# EAGLE design Aliexpress MMA8452 (EAGLE 9.2.2)
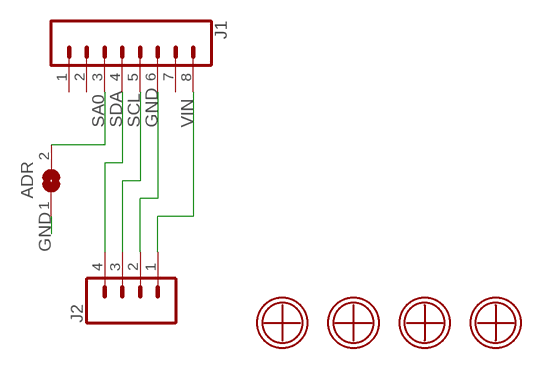
[diagram p0: schematic, sheet 1]

## Parts
ADR  SOLDERJUMPERREFLOW  [SOLDERJUMPER_REFLOW]
J1  CONN_08"  [1X08]
J2  CONN_04  [1X04]
U$1  3.2MM-5MM  [3.2MM-5MM]
U$2  3.2MM-5MM  [3.2MM-5MM]
U$3  3.2MM-5MM  [3.2MM-5MM]
U$4  3.2MM-5MM  [3.2MM-5MM]

## Nets
GND: ADR.1 J1.6 J2.2
SA0: ADR.2 J1.3
SCL: J1.5 J2.3
SDA: J1.4 J2.4
VIN: J1.8 J2.1
Unconnected: J1.1 J1.2 J1.7 U$1.P$1 U$2.P$1 U$3.P$1 U$4.P$1

## Library data of the parts
ADR = #microbuilder:SOLDERJUMPER: SMD Solder JUMPER Solder the two pads together to create a connection, or remove the solder to break it. REFLOW - Use this footprint for solder paste and reflow ovens. WAVE - Use this footprint for hand-soldering (larger pads). CLOSED - Has a trace between the two pads to ensure it is closed by default. The trace needs to be cut to disable the jumper, and can be closed again by creating a solder bridge between the two pads.
J1 = SparkFun-Connectors:CONN_08: Multi connection point. Often used as Generic Header-pin footprint for 0.1 inch spaced/style header connections On any of the 0.1 inch spaced packages, you can populate with these: Break Away Headers - Straight <https://www.sparkfun.com/products/116> (PRT-00116) Break Away Male Headers - Right Angle <https://www.sparkfun.com/products/553> (PRT-00553) Female Headers <https://www.sparkfun.com/products/115> (PRT-00115) Break Away Headers - Machine Pin <https://www.sparkfun.com/products/117> (PRT-00117) Break Away Female Headers - Swiss Machine Pin <https://www.sparkfun.com/products/743> (PRT-00743) Arduino Stackable Header - 8 Pin <https://www.sparkfun.com/products/9279> (PRT-09279) For SCREWTERMINALS and SPRING TERMINALS visit here: Screw Terimnals on SparkFun.com <https://www.sparkfun.com/search/results?term=Screw+Terminals> (5mm/3.5mm/2.54mm spacing) This device is also useful as a general connection point to wire up your design to another part of your project. Our various solder wires solder well into these plated through hole pads. Hook-Up Wire - Assortment (Stranded, 22 AWG) <https://www.sparkfun.com/products/11375> (PRT-11375) Hook-Up Wire - Assortment (Solid Core, 22 AWG) <https://www.sparkfun.com/products/11367> (PRT-11367) View the entire wire category on our website here <https://www.sparkfun.com/categories/141> Special notes: Molex polarized connector foot print use with SKU : PRT-08231 with associated crimp pins and housings. 1MM SMD Version SKU: PRT-10208 NOTES ON THE VARIANTS LOCK and LOCK_LONGPADS... This footprint was designed to help hold the alignment of a through-hole component (i.e. 6-pin header) while soldering it into place. You may notice that each hole has been shifted either up or down by 0.005 of an inch from it's more standard position (which is a perfectly straight line). This slight alteration caused the pins (the squares in the middle) to touch the edges of the holes. Because they are alternating, it causes a "brace" to hold the component in place. 0.005 has proven to be the perfect amount of "off-center" position when using our standard breakaway headers. Although looks a little odd when you look at the bare footprint, once you have a header in there, the alteration is very hard to notice. Also,if you push a header all the way into place, it is covered up entirely on the bottom side.; PROD_ID: CONN-08438
J2 = SparkFun-Connectors:CONN_04: Multi connection point. Often used as Generic Header-pin footprint for 0.1 inch spaced/style header connections On any of the 0.1 inch spaced packages, you can populate with these: Break Away Headers - Straight <https://www.sparkfun.com/products/116> (PRT-00116) Break Away Male Headers - Right Angle <https://www.sparkfun.com/products/553> (PRT-00553) Female Headers <https://www.sparkfun.com/products/115> (PRT-00115) Break Away Headers - Machine Pin <https://www.sparkfun.com/products/117> (PRT-00117) Break Away Female Headers - Swiss Machine Pin <https://www.sparkfun.com/products/743> (PRT-00743) For SCREWTERMINALS and SPRING TERMINALS visit here: Screw Terimnals on SparkFun.com <https://www.sparkfun.com/search/results?term=Screw+Terminals> (5mm/3.5mm/2.54mm spacing) This device is also useful as a general connection point to wire up your design to another part of your project. Our various solder wires solder well into these plated through hole pads. Hook-Up Wire - Assortment (Stranded, 22 AWG) <https://www.sparkfun.com/products/11375> (PRT-11375) Hook-Up Wire - Assortment (Solid Core, 22 AWG) <https://www.sparkfun.com/products/11367> (PRT-11367) View the entire wire category on our website here <https://www.sparkfun.com/categories/141> Special notes: Molex polarized connector foot print use with SKU : PRT-08231 with associated crimp pins and housings. 1MM SMD Version SKU: PRT-10208; PROD_ID: CONN-09696
U$1-U$4 = #Holes:3.2MM-5MM

## Board
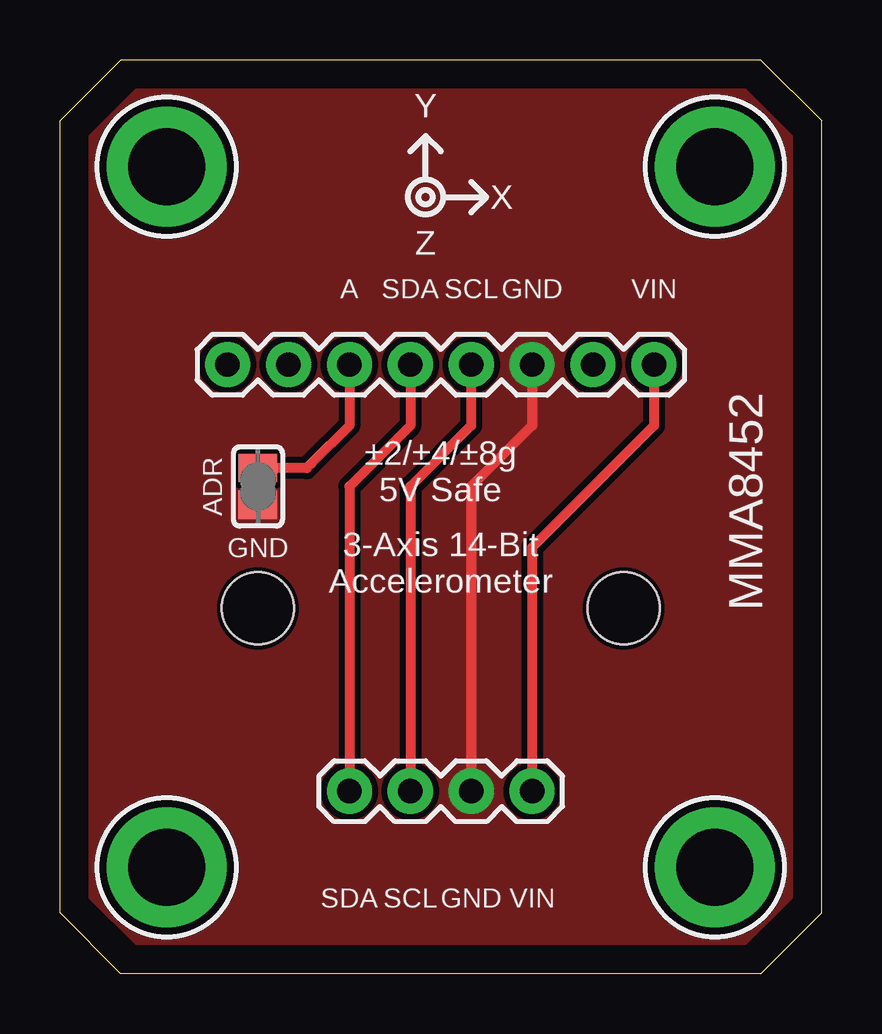
[diagram p1: board, top side]
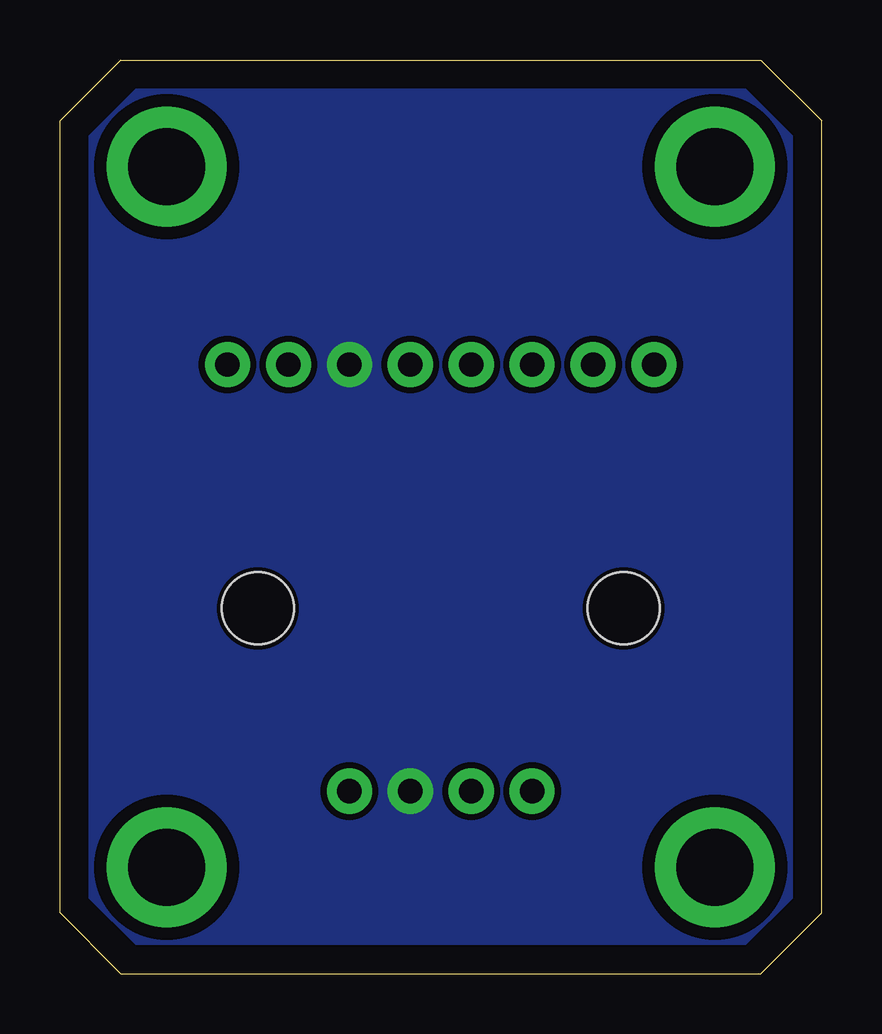
[diagram p2: board, bottom side, seen from below]

Size 31.75 x 38.1 mm. Coordinates in mm from the lower left corner, seen from the top.
Outline: 29.21,0 2.54,0 0,2.54 0,35.56 2.54,38.1 29.21,38.1 31.75,35.56 31.75,2.54 29.21,0
Copper layers (1*16): Top 0.035mm / dielectric 1.5mm / Bottom 0.035mm
Design rules "SparkFun 2 Layer Design Rule - STANDARD": minimum track width 10mil, minimum drill 20mil, track to track 10mil, track to pad 8mil, pad to pad 8mil, via to via 10mil, smd to smd 8mil, copper to edge 8mil, drill to drill 8mil, minimum pad ring 10mil, minimum via ring 10mil, stop-mask expansion 4mil, vias tented up to drill 25mil, thermal gap 10mil
Holes 3 mm at 8.25,15.24 23.5,15.24

### Footprints (pad centres in the part's own frame; a part is rotated, then mirrored left to right if it is on the bottom)
SOLDERJUMPER_REFLOW = smd 1.168 x 1.6: 1 -0.762,0; 2 0.762,0
1X08 = drill 1.016 pad 1.88: 1 0,0; 2 2.54,0; 3 5.08,0; 4 7.62,0; 5 10.16,0; 6 12.7,0; 7 15.24,0; 8 17.78,0
1X04 = drill 1.016 pad 1.88: 1 0,0; 2 2.54,0; 3 5.08,0; 4 7.62,0
3.2MM-5MM = drill 3.2 pad 5: P$1 0,0

### Placement (x,y rotation side)
ADR  8.25,20.32 90 top
J1  6.98,25.4 0 top
J2  19.69,7.62 180 top
U$1  4.45,33.66 0 top
U$2  27.3,33.66 0 top
U$3  4.45,4.45 0 top
U$4  27.3,4.45 0 top

### Tracks (layer width: path | path; a pad name or v marks a point on that pad's centre or on a via)
GND
  Top 0.406: J1.6 19.69,22.86 17.14,20.32 J2.2
  pour Bottom (no thermals): 3.18,36.83 28.57,36.83 30.48,34.92 30.48,3.17 28.57,1.27 3.18,1.27 1.27,3.17 1.27,34.92
  pour Top (no thermals): 3.18,36.83 28.57,36.83 30.48,34.92 30.48,3.17 28.57,1.27 3.18,1.27 1.27,3.17 1.27,34.92
SA0
  Top 0.406: J1.3 12.06,22.86 10.48,21.27 | 10.48,21.27 10.29,21.08 | 10.48,21.27 10.29,21.08 | 10.29,21.08 ADR.2
SCL
  Top 0.406: J2.3 14.6,20.32 17.14,22.86 J1.5
SDA
  Top 0.406: J2.4 12.06,20.32 14.6,22.86 J1.4
VIN
  Top 0.406: J1.8 24.77,22.86 19.69,17.78 J2.1

### Text on the board
tPlace: Y | X | Z | ±2/±4/±8g / 5V Safe | 3-Axis 14-Bit / Accelerometer
tNames: A | SDA | SCL | GND | VIN | ADR | MMA8452 | GND | SDA | SCL | GND | VIN